# Altium schematic sheet Feather M4 CAN Express.SchDoc
size A; SheetNumber: 2; SheetTotal: 2
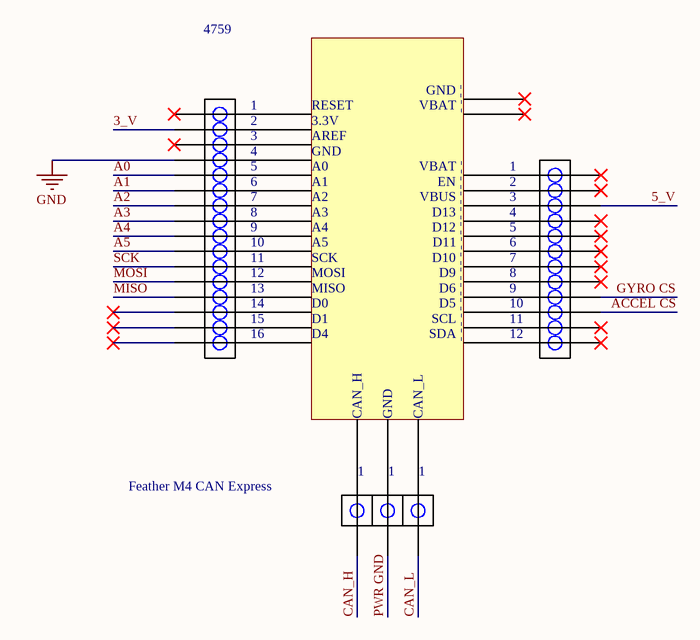
[diagram p0: Feather M4 CAN Express.SchDoc]

## Parts
4759  Feather M4 CAN Express  [Feather M4 CAN Express-Footprint-1]

## Nets
GND: 4759.GND
3_V: 4759.3.3V
5_V: 4759.VBUS
A0: 4759.A0
A1: 4759.A1
A2: 4759.A2
A3: 4759.A3
A4: 4759.A4
A5: 4759.A5
ACCEL CS: 4759.D5
CAN_H: 4759.CAN_H
CAN_L: 4759.CAN_L
GYRO CS: 4759.D6
MISO: 4759.MISO
MOSI: 4759.MOSI
PWR GND: 4759.GND
SCK: 4759.SCK

Not connected (* = marked no-connect by the designer): 4759 AREF* D0* D1* D4* D9* D10* D11* D12* D13* EN* RESET* SCL* SDA* VBAT*

## Notes on the sheet
- (in symbol CMP-001-0000-1) GND |; 1; VBAT |; 2; 3; 4; 5; 6; EN |; 7; VBUS |; 8; D13 |; 9; D12 |; 10; D11 |; 11; D10 |; 12; D9 |; 13; D6 |; 14; D5 |; 15; SCL |; 16; SDA |

## Library data of the parts
4759 = CMP-001-0000-1: Feather M4 Microcontroller with CAN; pin to pad: VBAT>null; Component Type: Miscellaneous